# Altium schematic sheet MCU.SchDoc: Titel
size A3; DesignedDate: 01-01-12; CompanyName: DCI Electronics bv; DrawnBy: KRS; Organization: DCI Electronics; Address1: Nijverheidsstraat 14; Address2: 4458 AV Eindewege; Address3: Phone: +31 (0)113 344880; DocumentNumber: 1; Revision: 1; SheetNumber: 2; SheetTotal: 5; PageSetup: Record=PageOptions|CenterHorizontal=True|CenterVertical=True|PrintScale=1.00|XCorrection=1.00|YCorrection=1.00|PrintKind=1|BorderSize=5000000|LeftOffset=0|BottomOffset=0|Orientation=2|PaperLength=1000|PaperWidth=1000|Scale=100|PaperSource=7|PrintQuality=-4|MediaType=1|DitherType=10|PaperKind=ISO_A4_(210.00_x_297.00_MM)|PrintScaleMode=1; SubTitle: SubTitel; ApprovedDate: 01-01-21; DesignedBy: KRS
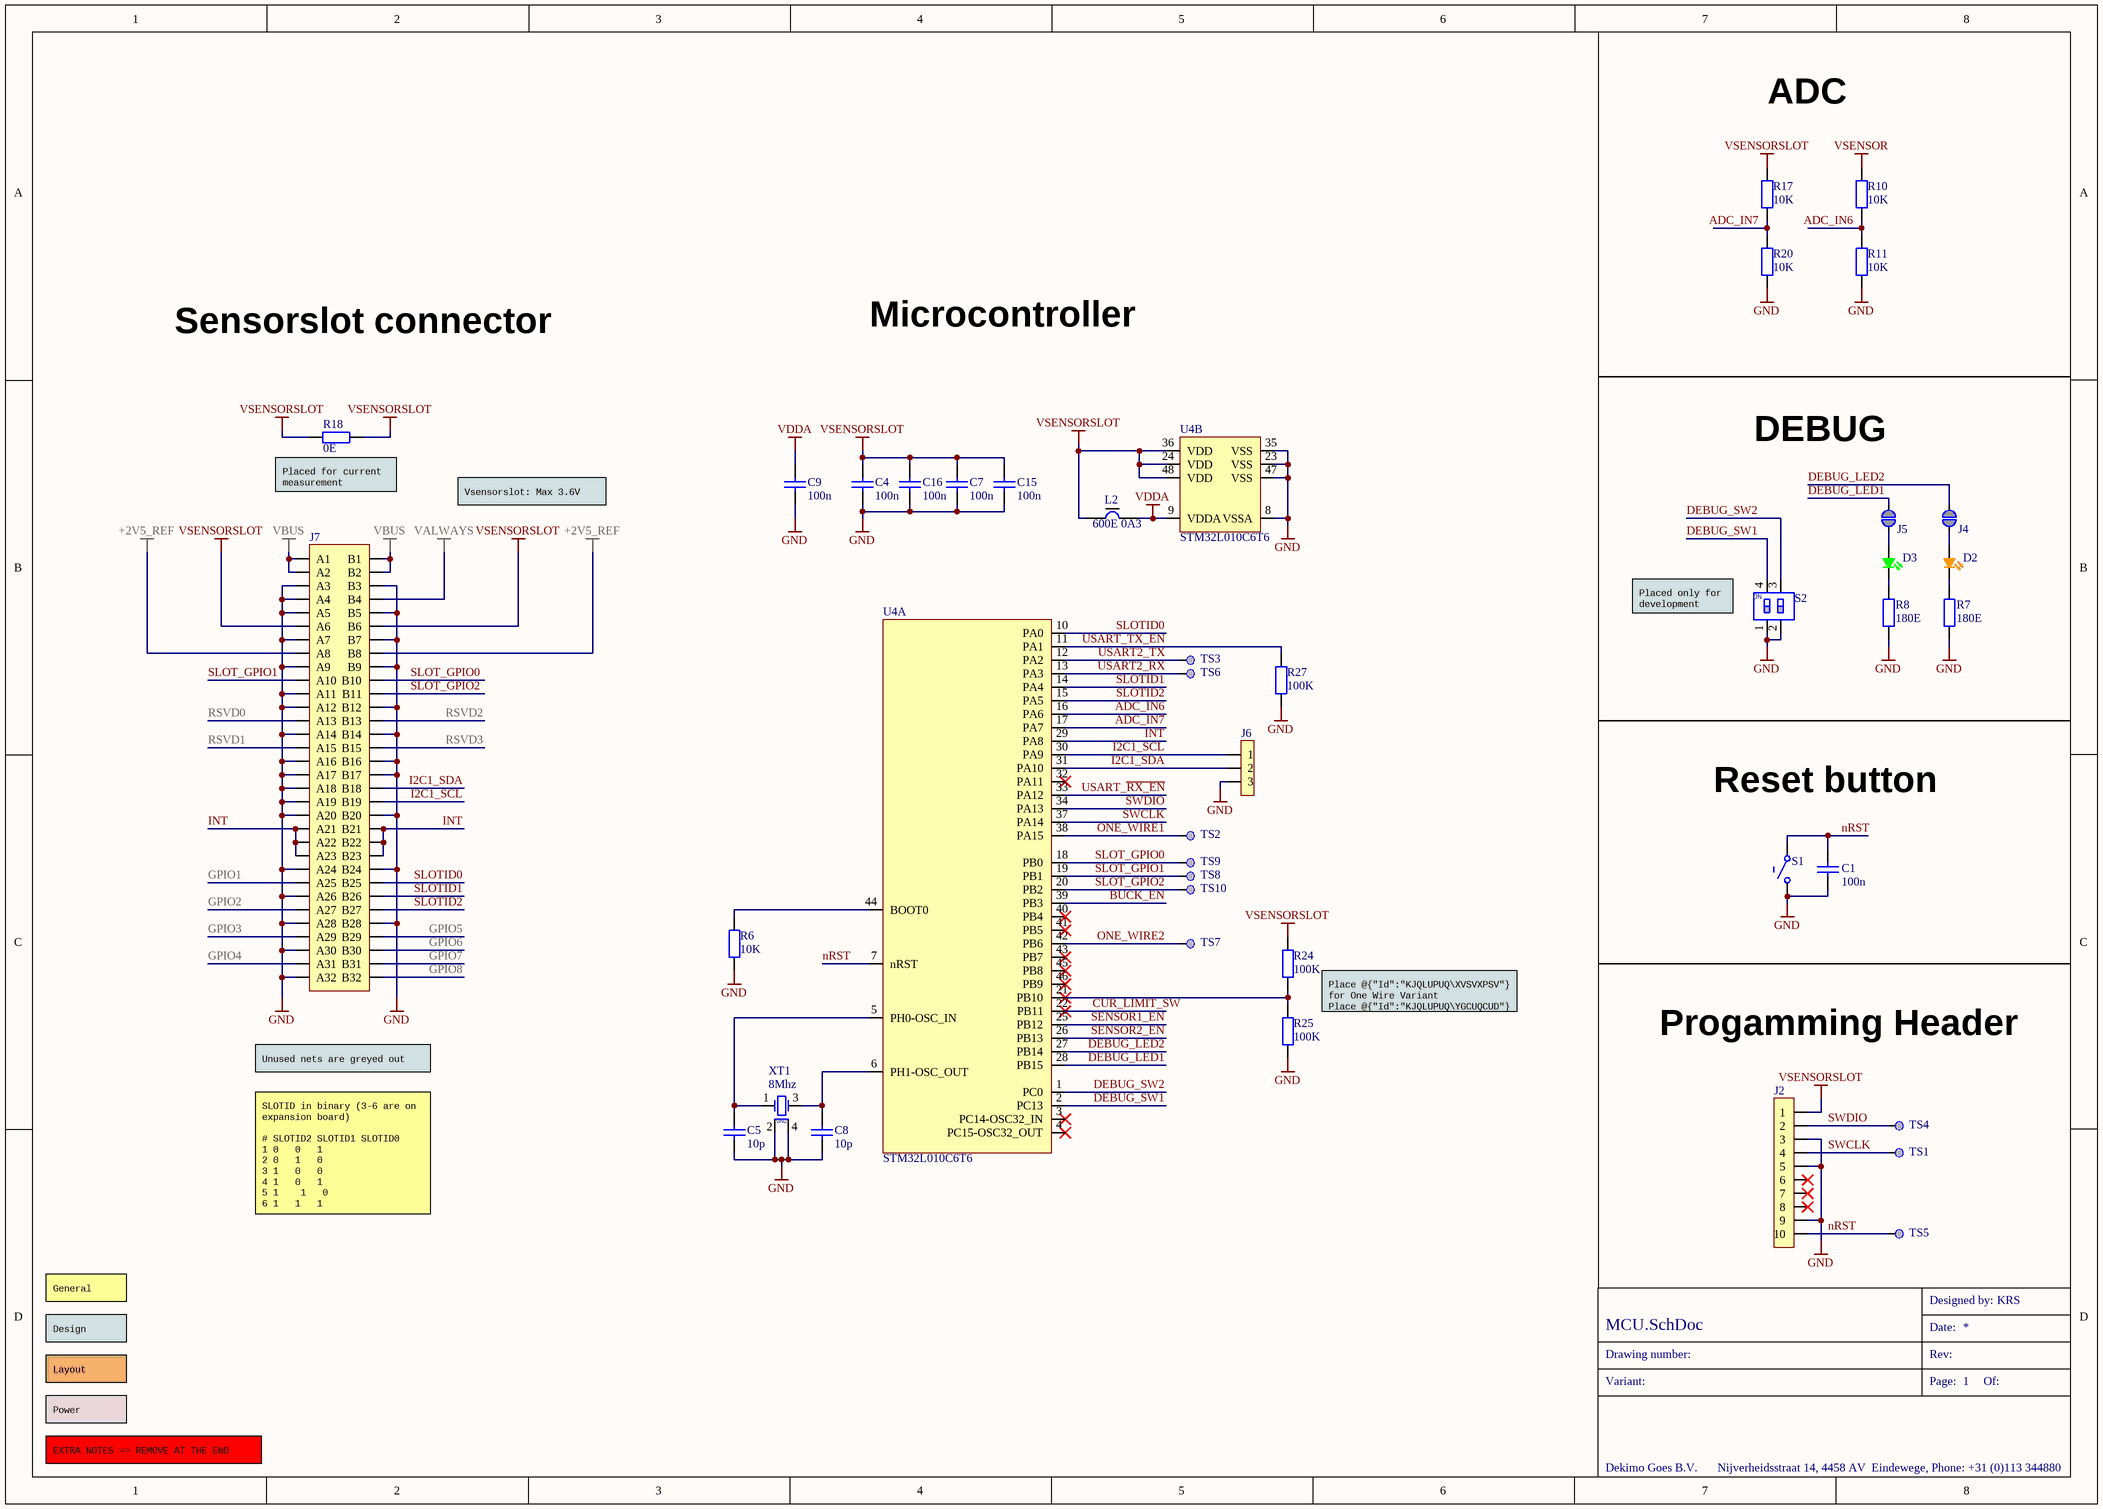
[diagram p0: MCU.SchDoc]

## Parts
C1  100n  [CAPC1608X09N]
C4  100n  [CAPC1608X09N]
C5  10p  [CAPC1608X09N]
C7  100n  [CAPC1608X09N]
C8  10p  [CAPC1608X09N]
C9  100n  [CAPC1608X09N]
C15  100n  [CAPC1608X09N]
C16  100n  [CAPC1608X09N]
D2  (no value)  [LED_0603]
D3  LED_GREEN  [LED_0603_ANODE]  (value not drawn)
J2  Harwin Archer M50 Series  [PHDR2X5_SMD_P1.27]  (value not drawn)
J4  (no value)  [Solderbridge NO]  (no BOM)
J5  (no value)  [Solderbridge NO]  (no BOM)
J6  (no value)  [PHDR1X3_P2.54]
J7  (no value)  [CON-900000-064]  (no BOM)
L2  600E 0A3  [INDC1608X10N]
R6  10K  [RESC1608X13N]
R7  180E  [RESC1608X13N]
R8  180E  [RESC1608X13N]
R10  10K  [RESC1608X13N]
R11  10K  [RESC1608X13N]
R17  10K  [RESC1608X13N]
R18  0E  [RESC1608X13N]
R20  10K  [RESC1608X13N]
R24  100K  [RESC1608X13N]
R25  100K  [RESC1608X13N]
R27  100K  [RESC1608X13N]
S1  (no value)  [B3S-1000P]
S2  (no value)  [SW_GDH02S04]
TS1  TESTPAD-1.5  [testpad 1.5 mm]  (value not drawn)  (no BOM)
TS2  TESTPAD-1.5  [testpad 1.5 mm]  (value not drawn)  (no BOM)
TS3  TESTPAD-1.5  [testpad 1.5 mm]  (value not drawn)  (no BOM)
TS4  TESTPAD-1.5  [testpad 1.5 mm]  (value not drawn)  (no BOM)
TS5  TESTPAD-1.5  [testpad 1.5 mm]  (value not drawn)  (no BOM)
TS6  TESTPAD-1.5  [testpad 1.5 mm]  (value not drawn)  (no BOM)
TS7  TESTPAD-1.5  [testpad 1.5 mm]  (value not drawn)  (no BOM)
TS8  TESTPAD-1.5  [testpad 1.5 mm]  (value not drawn)  (no BOM)
TS9  TESTPAD-1.5  [testpad 1.5 mm]  (value not drawn)  (no BOM)
TS10  TESTPAD-1.5  [testpad 1.5 mm]  (value not drawn)  (no BOM)
U4  STM32L010C6T6  [QFP-500001-048]  (parts A,B of 2)
XT1  8Mhz  [XTL-001G002-004]

## Blocks framed on the sheet
ADC: R10 R11 R17 R20
DEBUG: D2 D3 J4 J5 R7 R8 S2
Reset button: C1 S1
Progamming Header: J2 TS1 TS4 TS5

## Nets
+2V5_REF: J7.A8 J7.B8
GND: C1.1 C4.1 C5.1 C7.1 C8.1 C9.1 C15.1 C16.1 J2.3 J2.5 J2.9 J6.3 J7.A3 J7.A4 J7.A5 J7.A7 J7.A9 J7.A11 J7.A12 J7.A14 J7.A16 J7.A17 J7.A18 J7.A19 J7.A20 J7.A24 J7.A26 J7.A28 J7.A30 J7.A32 J7.B3 J7.B5 J7.B7 J7.B9 J7.B12 J7.B14 J7.B16 J7.B17 J7.B20 J7.B24 J7.B28 R6.1 R7.1 R8.1 R11.1 R20.1 R25.1 R27.1 S1.NO1(NO) S2.1(A1) S2.2(A2) U4.8(VSSA) U4.23(VSS) U4.35(VSS) U4.47(VSS) XT1.2 XT1.4
VALWAYS: J7.B4
VBUS: J7.A1 J7.A2 J7.B1 J7.B2
VDDA: C9.2 L2.2 U4.9(VDDA)
VSENSOR: R10.2
VSENSORSLOT: C4.2 C7.2 C15.2 C16.2 J2.1 J7.A6 J7.B6 L2.1 R17.2 R18.1 R18.2 R24.2 U4.24(VDD) U4.36(VDD) U4.48(VDD)
ADC_IN6: R10.1 R11.2 U4.16(PA6)
ADC_IN7: R17.1 R20.2 U4.17(PA7)
BUCK_EN: U4.39(PB3)
CUR_LIMIT_SW: U4.22(PB11)
DEBUG_LED1: J5.2 U4.28(PB15)
DEBUG_LED2: J4.2 U4.27(PB14)
DEBUG_SW1: S2.4(B1) U4.2(PC13)
DEBUG_SW2: S2.3(B2) U4.1(PC0)
GPIO1: J7.A25
GPIO2: J7.A27
GPIO3: J7.A29
GPIO4: J7.A31
GPIO5: J7.B29
GPIO6: J7.B30
GPIO7: J7.B31
GPIO8: J7.B32
I2C1_SCL: J6.1 J7.B19 U4.30(PA9)
I2C1_SDA: J6.2 J7.B18 U4.31(PA10)
INT: J7.A21 J7.A22 J7.A23 J7.B21 J7.B22 J7.B23 U4.29(PA8)
nRST: C1.2 J2.10 S1.COM1(COMMON) TS5.1(TP) U4.7(nRST)
ONE_WIRE1: TS2.1(TP) U4.38(PA15)
ONE_WIRE2: TS7.1(TP) U4.42(PB6)
RSVD0: J7.A13
RSVD1: J7.A15
RSVD2: J7.B13
RSVD3: J7.B15
SENSOR1_EN: U4.25(PB12)
SENSOR2_EN: U4.26(PB13)
SLOT_GPIO0: J7.B10 TS9.1(TP) U4.18(PB0)
SLOT_GPIO1: J7.A10 TS8.1(TP) U4.19(PB1)
SLOT_GPIO2: J7.B11 TS10.1(TP) U4.20(PB2)
SLOTID0: J7.B25 U4.10(PA0)
SLOTID1: J7.B26 U4.14(PA4)
SLOTID2: J7.B27 U4.15(PA5)
SWCLK: J2.4 TS1.1(TP) U4.37(PA14)
SWDIO: J2.2 TS4.1(TP) U4.34(PA13)
USART2_RX: TS6.1(TP) U4.13(PA3)
USART2_TX: TS3.1(TP) U4.12(PA2)
USART_~{RX_EN}: U4.33(PA12)
USART_TX_EN: R27.2 U4.11(PA1)
NetC5_2: C5.2 U4.5(PH0-OSC_IN) XT1.1(OSC1)
NetC8_2: C8.2 U4.6(PH1-OSC_OUT) XT1.3(OSC2)
NetD2_A: D2.A J4.1
NetD2_C: D2.C R7.2
NetD3_A: D3.A J5.1
NetD3_C: D3.C R8.2
NetR6_2: R6.2 U4.44(BOOT0)
NetR24_1: R24.1 R25.2 U4.21(PB10)

Not connected (* = marked no-connect by the designer): J2 6* 7* 8*; U4 3(PC14-OSC32_IN)* 4(PC15-OSC32_OUT)* 32(PA11)* 40(PB4)* 41(PB5)* 43(PB7)* 45(PB8)* 46(PB9)*

## Notes on the sheet
- Sensorslot connector
- Microcontroller
- (near R18) Placed for current measurement
- Vsensorslot: Max 3.6V
- (near S2) Placed only for development
- Place @{"Id":"KJQLUPUQ\XVSVXPSV"} for One Wire Variant
  Place @{"Id":"KJQLUPUQ\YGCUQCUD"} for RS485 Variant
- Unused nets are greyed out
- SLOTID in binary (3-6 are on expansion board)
  # SLOTID2 SLOTID1 SLOTID0
  1 0	  0	  1
  2 0	  1	  0
  3 1	  0	  0
  4 1	  0	  1
  5 1 	  1	  0
  6 1	  1	  1
- General
- Design
- Layout
- Power
- EXTRA NOTES => REMOVE AT THE END
- Designed by:
- Drawing number:
- Variant:
- Date:
- Page:
- Rev:
- Of:
- Dekimo Goes B.V.
- Nijverheidsstraat 14, 4458 AV  Eindewege, Phone: +31 (0)113 344880
- (in symbol SW DIP2SO/G2) ON
- (in symbol XT 8MHZ/1) GND

## Library data of the parts
C1 C4 C7 C9 C15 C16 = CKE 100N/60: 100nF 50V 10% X7R; EngPartGrpMainCode: CAP; ManufactpartCode: CC0603KRX7R9BB104-YAG; Type: Capacitor ceramic SMD; Preferred: False; SMD_Flag: True; PartCode: CKE 100N/60
C5 C8 = CKE 10P/60: 10pF 50V 5% C0G/NP0; EngPartGrpMainCode: CAP; ManufactpartCode: C1608C0G1H100D080AA-TDK; Type: Capacitor ceramic SMD; Preferred: False; SMD_Flag: True; PartCode: CKE 10P/60
D2 = LED SMDO/3: Led Orange 0603; EngPartGrpMainCode: OPTO; ManufactpartCode: 150060AS75000-WE; Type: LED SMD; Preferred: False; SMD_Flag: True; PartCode: LED SMDO/3
D3 = LED SMDG/16: Led Groen 0603; EngPartGrpMainCode: OPTO; ManufactpartCode: 150060VS75003-WE; Type: LED SMD; Preferred: False; SMD_Flag: True; PartCode: LED SMDG/16
J2 = CON PHDR2X5S/10: pinh 2x5/straight/Au/1.27pitch; EngPartGrpMainCode: CONN; ManufactpartCode: M50-3600542-HAR; Preferred: False; SMD_Flag: True; PartCode: CON PHDR2X5S/10; Type: Connector pinhdr SMD
J4 J5 = SolderbridgeNO: Solderbridge  - Normally Open
J6 = CON PHDR1X3S/1: pinh 1x3/straight/h=5.8/Au; EngPartGrpMainCode: CONN; ManufactpartCode: 0-826629-3; Preferred: False; PartCode: CON PHDR1X3S/1; Type: Connector Pinheader; SMD_Flag: False
J7 = PCIe x4 Card edge
L2 = IND 600E 0A3/1: 600E @100Mhz 0.3A; EngPartGrpMainCode: IND; ManufactpartCode: 742792653-WE; Type: Ferrite bead SMD; Preferred: False; SMD_Flag: True; PartCode: IND 600E 0A3/1
R6 R10 R11 R17 R20 = R 10K/60: 10k 100mW, 1%; EngPartGrpMainCode: RES; ManufactpartCode: RC0603FR-0710KL-YAG; Preferred: True; PartCode: R 10K/60; Type: Resistor metalfilm SMD; SMD_Flag: True
R7 R8 = R 180E/60: 180E 0.1W 1%; EngPartGrpMainCode: RES; ManufactpartCode: RC0603FR-07180RL-YAG; Preferred: False; SMD_Flag: True; PartCode: R 180E/60; Type: Resistor metalfilm SMD
R18 = R 0E/60: 0E 100mW, 1%; PartCode: R 0E/60; EngPartGrpMainCode: RES; ManufactpartCode: RC0603FR-070RL-YAG; Preferred: True; Type: Resistor metalfilm SMD; SMD_Flag: True
R24 R25 R27 = R 100K/60: 100k 100mW, 1%; EngPartGrpMainCode: RES; ManufactpartCode: CRG0603F100K-TEC; Preferred: True; PartCode: R 100K/60; Type: Resistor metalfilm SMD; SMD_Flag: True
S1 = SW PBSPNO/25: PCB SPNO 6x6.6mm, h=4,3mm refl; EngPartGrpMainCode: SWI; ManufactpartCode: B3S-1000P-OMR; Preferred: False; SMD_Flag: True; PartCode: SW PBSPNO/25; Type: Switch push button SMD
S2 = SW DIP2SO/G2: DIP,2p,Straight,H=2,3mm,SMD,AU; EngPartGrpMainCode: SWI; ManufactpartCode: GDH02S04-TYC; Preferred: False; SMD_Flag: True; PartCode: SW DIP2SO/G2; Type: Switch slide SMD
TS1-TS10 = TESTPAD-1.5: 1.5mm Testpad SMD; PartCode: TESTPAD-1.5
U4 = IC STM32L010C6T: EngPartGrpMainCode: IC; ManufactpartCode: STM32L010C6T6-STM; Preferred: False; SMD_Flag: True; ComponentLink2Description: Datasheet; ComponentLink2URL: https://nl.mouser.com/datasheet/2/389/stm32l010c6-1760926.pdf; Supplier 1: Mouser; Supplier 2: Digi-Key; Supplier 3: Farnell; Supplier Part Number 1: 511-STM32L010C6T6; Supplier Part Number 2: 497-19662-ND; Supplier Part Number 3: 2980880; PartCode: IC STM32L010C6T; Type: IC microcontroller SMD
XT1 = XT 8MHZ/1: 8 MHz, 10%, 30ppm; EngPartGrpMainCode: XTAL; ManufactpartCode: ECS-80-10-33-CGN-TR3-ECS; Preferred: False; SMD_Flag: True; PartCode: XT 8MHZ/1; Type: Quarz crystal SMD